# EAGLE schematic boardv2temperature (EAGLE 6.6.0)
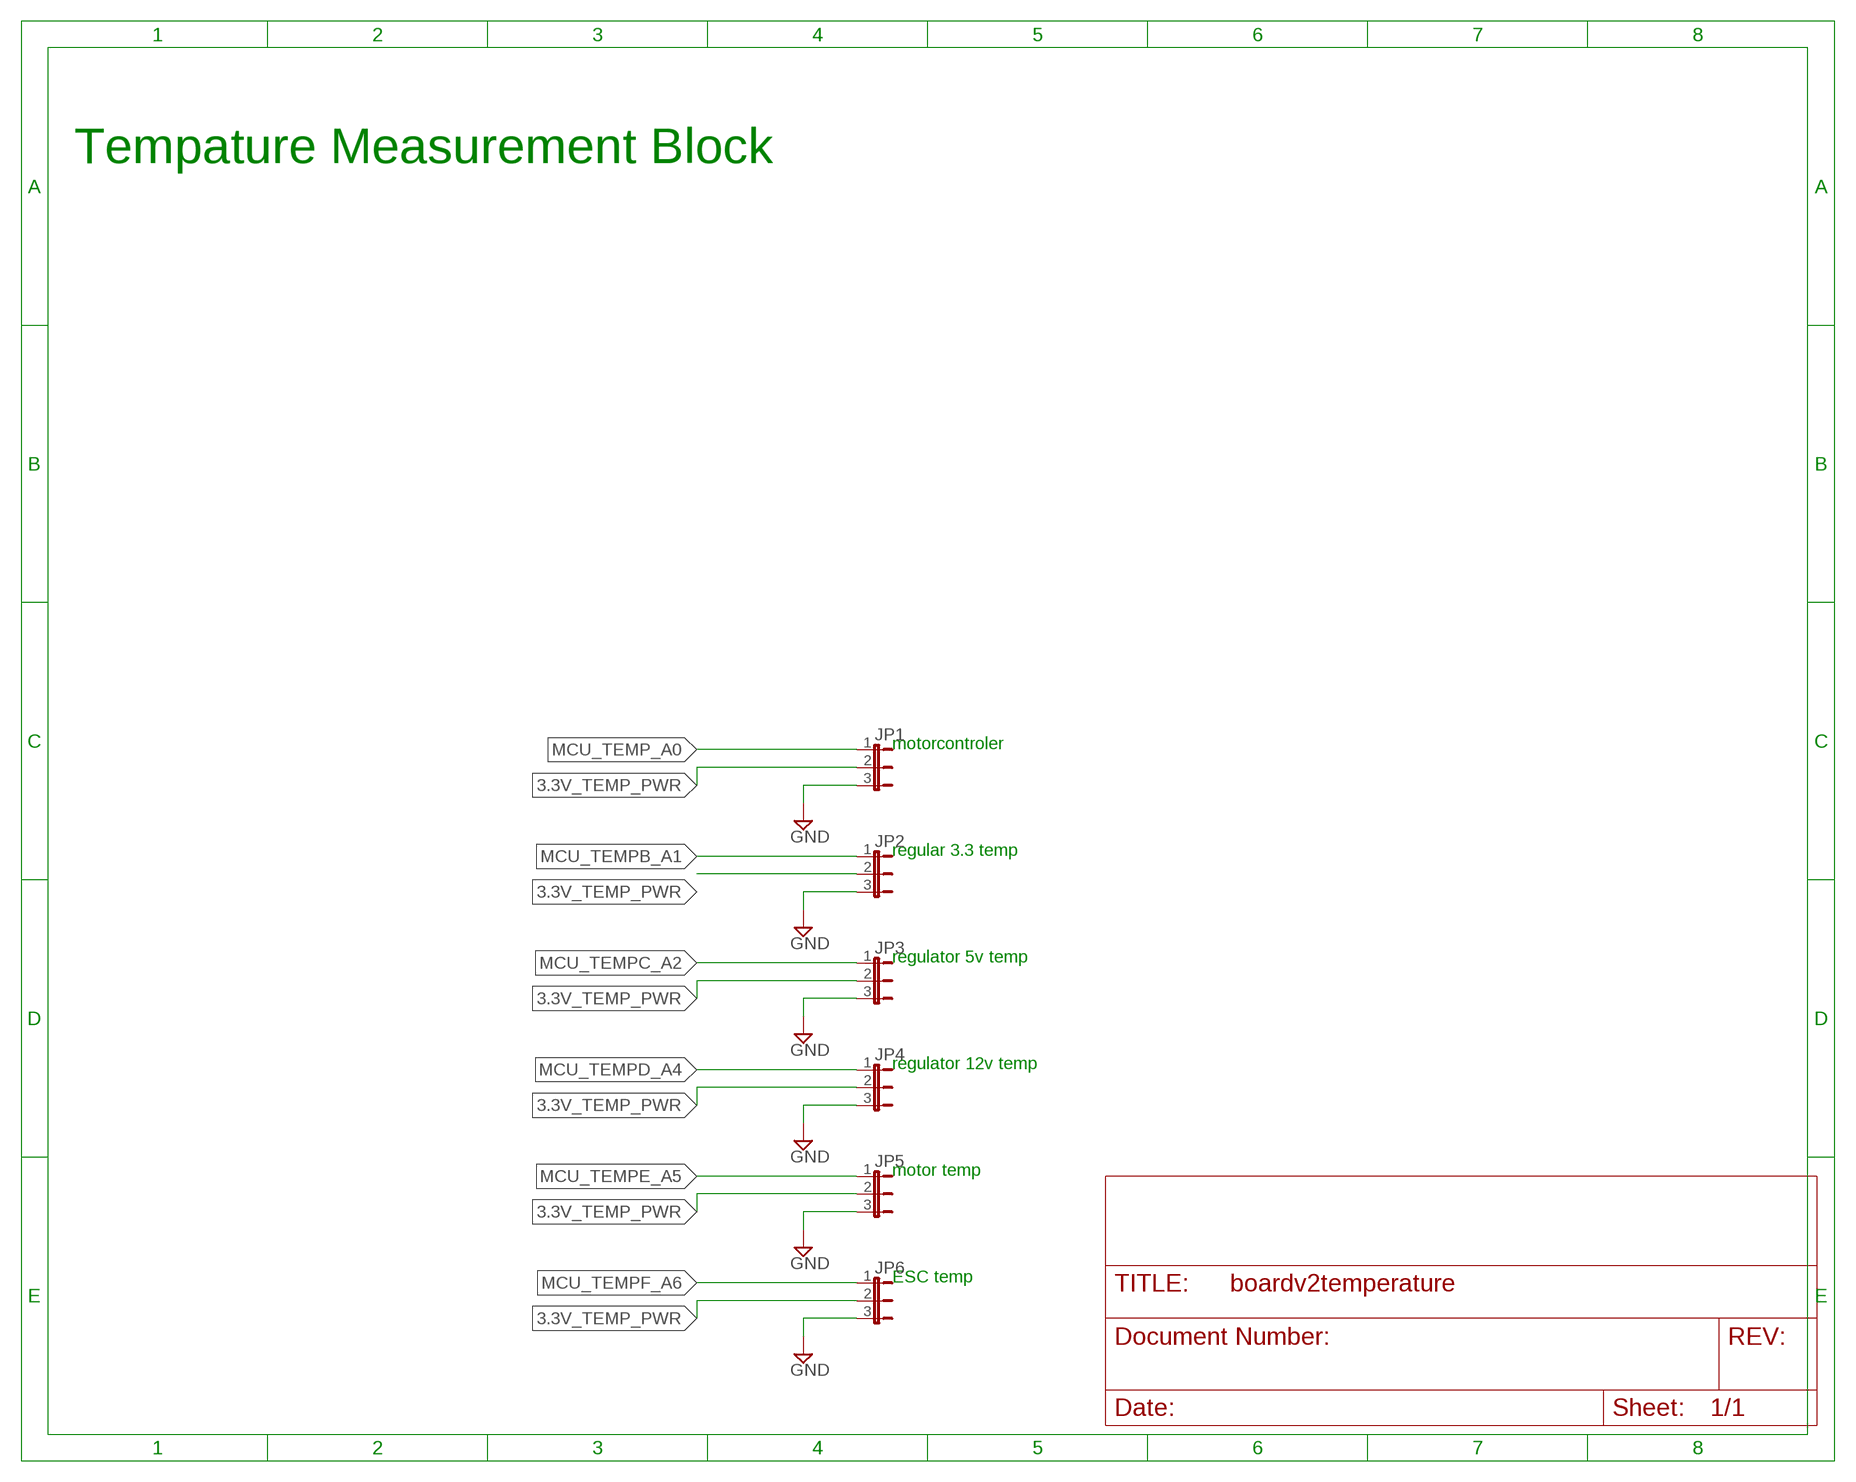
[diagram p0: schematic, sheet 1]

## Parts
JP1  JP2E  [JP2]
JP2  JP2E  [JP2]
JP3  JP2E  [JP2]
JP4  JP2E  [JP2]
JP5  JP2E  [JP2]
JP6  JP2E  [JP2]

## Nets
3.3V_TEMP_PWR: JP1.2 JP2.2 JP3.2 JP4.2 JP5.2 JP6.2
GND: JP1.3 JP2.3 JP3.3 JP4.3 JP5.3 JP6.3
MCU_TEMP_A0: JP1.1
MCU_TEMPB_A1: JP2.1
MCU_TEMPC_A2: JP3.1
MCU_TEMPD_A4: JP4.1
MCU_TEMPE_A5: JP5.1
MCU_TEMPF_A6: JP6.1

## Notes on the sheet
- Tempature Measurement Block
- motorcontroler
- regular 3.3 temp
- regulator 5v temp
- regulator 12v temp
- motor temp
- ESC temp

## Library data of the parts
JP1-JP6 = jumper:JP2E: JUMPER